# Altium schematic sheet MCU_MKE185F512VLH16.SchDoc: Microcontroller
size A4; DrawnBy: Alvin Ha; DocumentNumber: MCU2018-2; Revision: 2.0; SheetNumber: 2; SheetTotal: 4
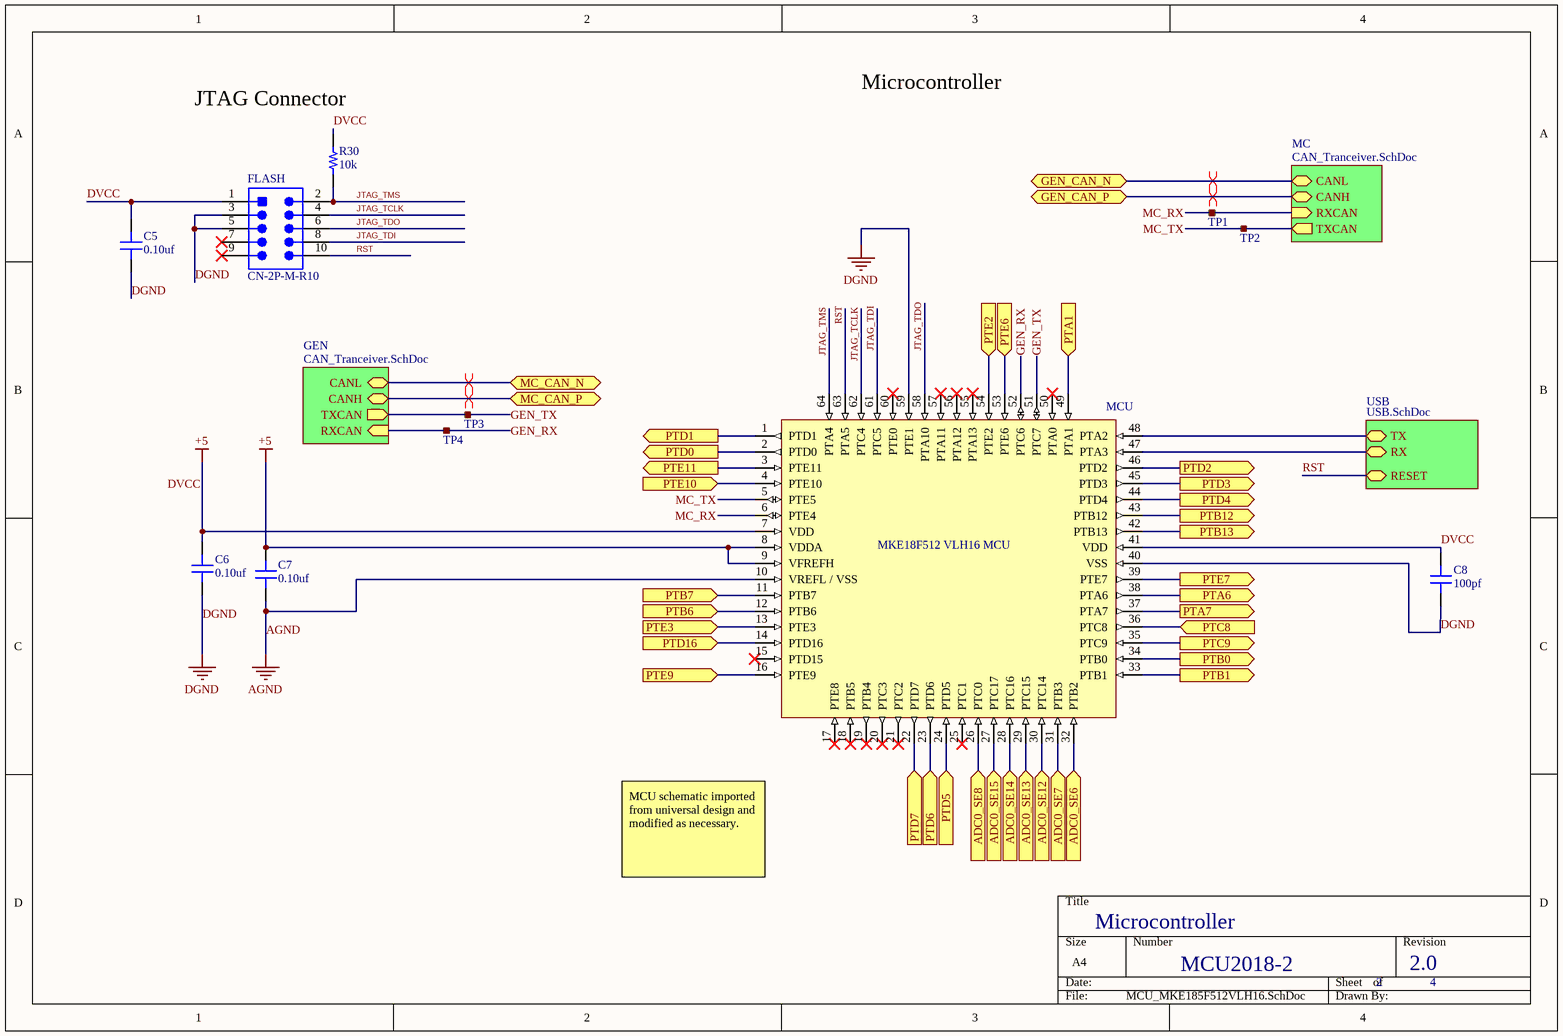
[diagram p0: MCU_MKE185F512VLH16.SchDoc]

## Parts
C5  value 0.10uf  [CAP 0603/1608]  (hidden comment: Capacitor MLCC 0.10uf 16V CAP 0603/1608)
C6  value 0.10uf  [CAP 0603/1608]  (hidden comment: Capacitor MLCC 0.10uf 25V CAP 0603/1608)
C7  value 0.10uf  [CAP 0603/1608]  (hidden comment: Capacitor MLCC 0.10uf 25V CAP 0603/1608)
C8  value 100pf  [CAP 0603/1608]  (hidden comment: Capacitor MLCC 100pf 25V CAP 0603/1608)
FLASH  CN-2P-M-R10  [HDR2X5_SMT]
MCU  MKE18F512 VLH16 MCU  [TQFP64]
R30  value 10k  [RES 0603/1608]  (hidden comment: Resistor 10k 0603 1/10W 1%)
TP1  RCU-0C  [RCU-0C]  (value not drawn)
TP2  RCU-0C  [RCU-0C]  (value not drawn)
TP3  RCU-0C  [RCU-0C]  (value not drawn)
TP4  RCU-0C  [RCU-0C]  (value not drawn)

## Sub-sheets
GEN = CAN_Tranceiver.SchDoc: CANL (bidir), CANH (bidir), RXCAN (in), TXCAN (out)
MC = CAN_Tranceiver.SchDoc: CANL (bidir), CANH (bidir), RXCAN (in), TXCAN (out)
USB = USB.SchDoc: TX (bidir), RESET (bidir), RX (bidir)

## Ports
ADC0_SE6 (in), ADC0_SE7 (in), ADC0_SE8 (in), ADC0_SE12 (in), ADC0_SE13 (in), ADC0_SE14 (in), ADC0_SE15 (in), GEN_CAN_N (bidir), GEN_CAN_P (bidir), MC_CAN_N (bidir), MC_CAN_P (bidir), PTA1 (in), PTA6 (out), PTA7 (out), PTB0 (out), PTB1 (out), PTB6 (in), PTB7 (in), PTB12 (out), PTB13 (out), PTC8 (in), PTC9 (out), PTD0 (out), PTD1 (out), PTD2 (out), PTD3 (out), PTD4 (out), PTD5 (in), PTD6 (in), PTD7 (in), PTD16 (in), PTE2 (in), PTE3 (in), PTE6 (in), PTE7 (out), PTE9 (in), PTE10 (in), PTE11 (out)

## Nets
AGND: C7.1 MCU.10(VREFL_/_VSS)
DGND: C5.1 C6.1 C8.1 FLASH.3 FLASH.5 MCU.40(VSS) MCU.59(PTE1)
DVCC: C5.2 C6.2 C7.2 C8.2 FLASH.1 MCU.7(VDD) MCU.8(VDDA) MCU.9(VFREFH) MCU.41(VDD) R30.2  [also labelled +5]
ADC0_SE6: MCU.32(PTB2) ; port ADC0_SE6
ADC0_SE7: MCU.31(PTB3) ; port ADC0_SE7
ADC0_SE8: MCU.26(PTC0) ; port ADC0_SE8
ADC0_SE12: MCU.30(PTC14) ; port ADC0_SE12
ADC0_SE13: MCU.29(PTC15) ; port ADC0_SE13
ADC0_SE14: MCU.28(PTC16) ; port ADC0_SE14
ADC0_SE15: MCU.27(PTC17) ; port ADC0_SE15
GEN_CAN_N: port GEN_CAN_N, sheet MC/CANL
GEN_CAN_P: port GEN_CAN_P, sheet MC/CANH
GEN_RX: MCU.52(PTC6) TP4.1 ; sheet GEN/RXCAN
GEN_TX: MCU.51(PTC7) TP3.1 ; sheet GEN/TXCAN
JTAG_TCLK: FLASH.4 MCU.62(PTC4)
JTAG_TDI: FLASH.8 MCU.61(PTC5)
JTAG_TDO: FLASH.6 MCU.58(PTA10)
JTAG_TMS: FLASH.2 MCU.64(PTA4) R30.1
MC_CAN_N: port MC_CAN_N, sheet GEN/CANL
MC_CAN_P: port MC_CAN_P, sheet GEN/CANH
MC_RX: MCU.6(PTE4) TP1.1 ; sheet MC/RXCAN
MC_TX: MCU.5(PTE5) TP2.1 ; sheet MC/TXCAN
PTA1: MCU.49(PTA1) ; port PTA1
PTA6: MCU.38(PTA6) ; port PTA6
PTA7: MCU.37(PTA7) ; port PTA7
PTB0: MCU.34(PTB0) ; port PTB0
PTB1: MCU.33(PTB1) ; port PTB1
PTB6: MCU.12(PTB6) ; port PTB6
PTB7: MCU.11(PTB7) ; port PTB7
PTB12: MCU.43(PTB12) ; port PTB12
PTB13: MCU.42(PTB13) ; port PTB13
PTC8: MCU.36(PTC8) ; port PTC8
PTC9: MCU.35(PTC9) ; port PTC9
PTD0: MCU.2(PTD0) ; port PTD0
PTD1: MCU.1(PTD1) ; port PTD1
PTD2: MCU.46(PTD2) ; port PTD2
PTD3: MCU.45(PTD3) ; port PTD3
PTD4: MCU.44(PTD4) ; port PTD4
PTD5: MCU.24(PTD5) ; port PTD5
PTD6: MCU.23(PTD6) ; port PTD6
PTD7: MCU.22(PTD7) ; port PTD7
PTD16: MCU.14(PTD16) ; port PTD16
PTE2: MCU.54(PTE2) ; port PTE2
PTE3: MCU.13(PTE3) ; port PTE3
PTE6: MCU.53(PTE6) ; port PTE6
PTE7: MCU.39(PTE7) ; port PTE7
PTE9: MCU.16(PTE9) ; port PTE9
PTE10: MCU.4(PTE10) ; port PTE10
PTE11: MCU.3(PTE11) ; port PTE11
RST: FLASH.10 MCU.63(PTA5) ; sheet USB/RESET
NetMCU_47: MCU.47(PTA3) ; sheet USB/RX
NetMCU_48: MCU.48(PTA2) ; sheet USB/TX

Not connected (* = marked no-connect by the designer): FLASH 7* 9*; MCU 15(PTD15)* 17(PTE8)* 18(PTB5)* 19(PTB4)* 20(PTC3)* 21(PTC2)* 25(PTC1)* 50(PTA0)* 55(PTA13)* 56(PTA12)* 57(PTA11)* 60(PTE0)*

## Layout directives
differential pair: GEN_CAN_N, GEN_CAN_P, MC_CAN_N, MC_CAN_P

## Notes on the sheet
- (near R30) JTAG Connector
- Microcontroller
- MCU schematic imported from universal design and modified as necessary.

## Library data of the parts
C5 = 223: Manufacturer_id: 1; idCapacitor: 223; Name: Cap_0.10uf_16V_CAP 0603/1608; Dielectric: Ceramic; Created_By: Nick Mah; Drawer_id: 1; Voltage_Rating: 16V; Package: CAP 0603/1608; Created_Date: 10/20/2018
C6 C7 = 583: Manufacturer_id: 1; idCapacitor: 583; Name: Cap_0.10uf_25V_CAP 0603/1608; Dielectric: Ceramic; Created_By: Nick Mah; Drawer_id: 1; Voltage_Rating: 25V; Package: CAP 0603/1608; Created_Date: 10/20/2018
C8 = 529: Manufacturer_id: 1; idCapacitor: 529; Name: Cap_100pf_25V_CAP 0603/1608; Dielectric: Ceramic; Created_By: Nick Mah; Drawer_id: 1; Voltage_Rating: 25V; Package: CAP 0603/1608; Created_Date: 10/20/2018
FLASH = 4: 2 row connector; Manufacturer_id: 1; MfrPartNo: 5103309-1; idConn: 4; Name: CONN_TE_2X5POS; Value: CONN; Voltage_Rating: None; Num_Contacts: 10; Num_Rows: 2; Pitch: 2.54mm; Created_By: Aiku; Drawer_id: 1; Link: https://www.digikey.com/product-detail/en/5103309-1/A33160-ND/1114898?utm_campaign=buynow&WT.z_cid=ref_octopart_dkc_buynow&utm_medium=aggregator&curr=usd&site=us&utm_source=octopart; ComponentLink1Description: Datasheet
MCU = 1: idMCU: 1; Manufacturer_id: 1; Drawer_id: 1; Name: MKE18F512VLH16 MCU
R30 = 313: Manufacturer_id: 1; idResistor: 313; Name: Res_10k_0603_1/10W_1%; Created_By: Nick Mah; Supplier 1: Digi-Key; Drawer_id: 1; Tolerance: 1%; Power: 1/10W; Package: 0603; ComponentLink1Description: Datasheet; Created_Date: 2018-10-20
TP1-TP4 = 5: Manufacturer_id: 1; idTable: 5; Name: RCU-0C_Test_Point; Drawer_id: 1; Package: 0603; MfrPartNo: RCU-0C; Link: https://www.digikey.com/product-detail/en/te-connectivity-amp-connectors/RCU-0C/A106145CT-ND/3477802; ComponentLink1Description: Datasheet; ComponentLink1URL: https://www.te.com/commerce/DocumentDelivery/DDEController?Action=srchrtrv&DocNm=1773266&DocType=DS&DocLang=English